# EAGLE schematic Tetris (EAGLE 7.6.0)
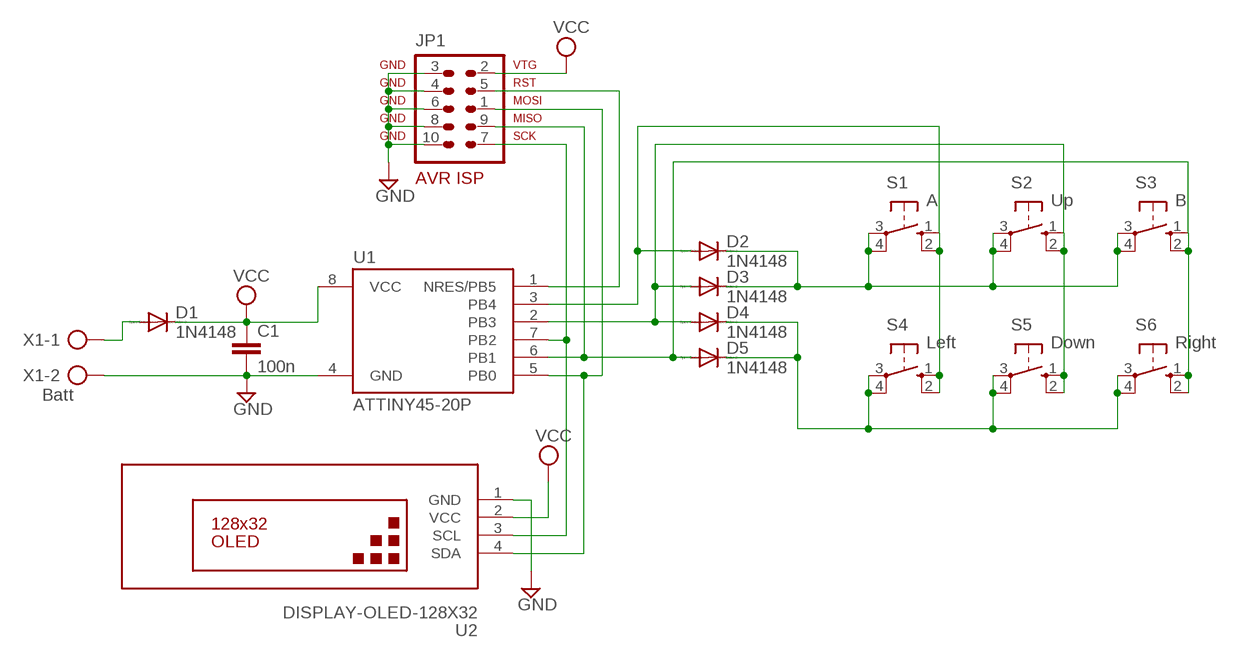
[diagram p0: schematic, sheet 1]

## Parts
C1  100n  C-EU025-024X044  [C025-024X044]
D1  1N4148  1N4148DO35-7  [DO35-7]
D2  1N4148  1N4148DO35-7  [DO35-7]
D3  1N4148  1N4148DO35-7  [DO35-7]
D4  1N4148  1N4148DO35-7  [DO35-7]
D5  1N4148  1N4148DO35-7  [DO35-7]
JP1  AVR-ISP-10  [AVR-ISP-10]
S1  A  10-XX  [B3F-10XX]
S2  Up  10-XX  [B3F-10XX]
S3  B  10-XX  [B3F-10XX]
S4  Left  10-XX  [B3F-10XX]
S5  Down  10-XX  [B3F-10XX]
S6  Right  10-XX  [B3F-10XX]
U1  ATTINY45-20P  [PDIP08_300MIL]
U2  DISPLAY-OLED-128X32  [DISPLAY-OLED-128X32]
X1  Batt  AK500/2  [AK500/2]

## Nets
GND: C1.2 JP1.3 JP1.4 JP1.6 JP1.8 JP1.10 U1.4(GND) U2.1(GND) X1.2
N$1: D1.A X1.1
N$5: D5.A JP1.9 S3.1(S) S3.2(S1) S6.1(S) S6.2(S1) U1.6(PB1)
N$6: D3.A D4.A S2.1(S) S2.2(S1) S5.1(S) S5.2(S1) U1.2(PB3)
N$7: D2.A S1.1(S) S1.2(S1) S4.1(S) S4.2(S1) U1.3(PB4)
N$8: D2.C D3.C S1.3(P) S1.4(P1) S2.3(P) S2.4(P1) S3.3(P) S3.4(P1)
N$9: D4.C D5.C S4.3(P) S4.4(P1) S5.3(P) S5.4(P1) S6.3(P) S6.4(P1)
N$11: JP1.5 U1.1(NRES/PB5)
N$12: JP1.1 U1.5(PB0) U2.4(SDA)
N$14: JP1.7 U1.7(PB2) U2.3(SCL)
VCC: C1.1 D1.C JP1.2 U1.8(VCC) U2.2(VCC)

## Library data of the parts
C1 = rcl:C-EU: CAPACITOR, European symbol
D1-D5 = diode:1N4148: DIODE high speed (Philips)
JP1 = avr-7:AVR-ISP-10: AVR ISP-10 Serial Programming Header
S1-S6 = switch-omron:10-XX: OMRON SWITCH; MPN: B3F-1000; OC_FARNELL: 176432; OC_NEWARK: 36M3542
U1 = _hhn_attiny25_45_85:ATTINY45*: ATMEL ATtiny 45 Packages: P = PDIP 08 30mil S = SOIC 08 EIAJ 208mil X = TSSOP 08 4.4mm Technologies Note: for complete ordering code (temp. range, finish, tape&reel etc.) see www.atmel.com • Supply Voltage: V = (1.8…5.5)V | [blank] = (2.7…5.5)V • Speed: 10 = 10 MHz | 20 = 20 MHz Author: Dipl.-Ing. FH Rainer Bayer HHN Hochschule Heilbronn (Heilbronn University), rainer.bayer@hs-heilbronn.de Ingenieurbüro ing-rb, mail@ing-rb.de
U2 = diy-modules:DISPLAY-OLED-128X32: 128x32 Dot Matrix OLED Module with I2C interface based on SSD1306 chip More details available here: http://www.tinyosshop.com/index.php?route=product/product&product_id=953 Schematic available here: http://www.tinyosshop.com/datasheet/OLED%2012832.pdf SSD1306 datasheet: https://cdn-shop.adafruit.com/datasheets/SSD1306.pdf Click here to find device on ebay.com <http://www.ebay.com/sch/oled+display+128x32+i2c>
X1 = con-ptr500:AK500/2: CONNECTOR; OC_FARNELL: unknown; OC_NEWARK: unknown